# Altium schematic sheet MCU.chDoc.SchDoc
size A4; Revision: 0; SheetNumber: 4; SheetTotal: 4
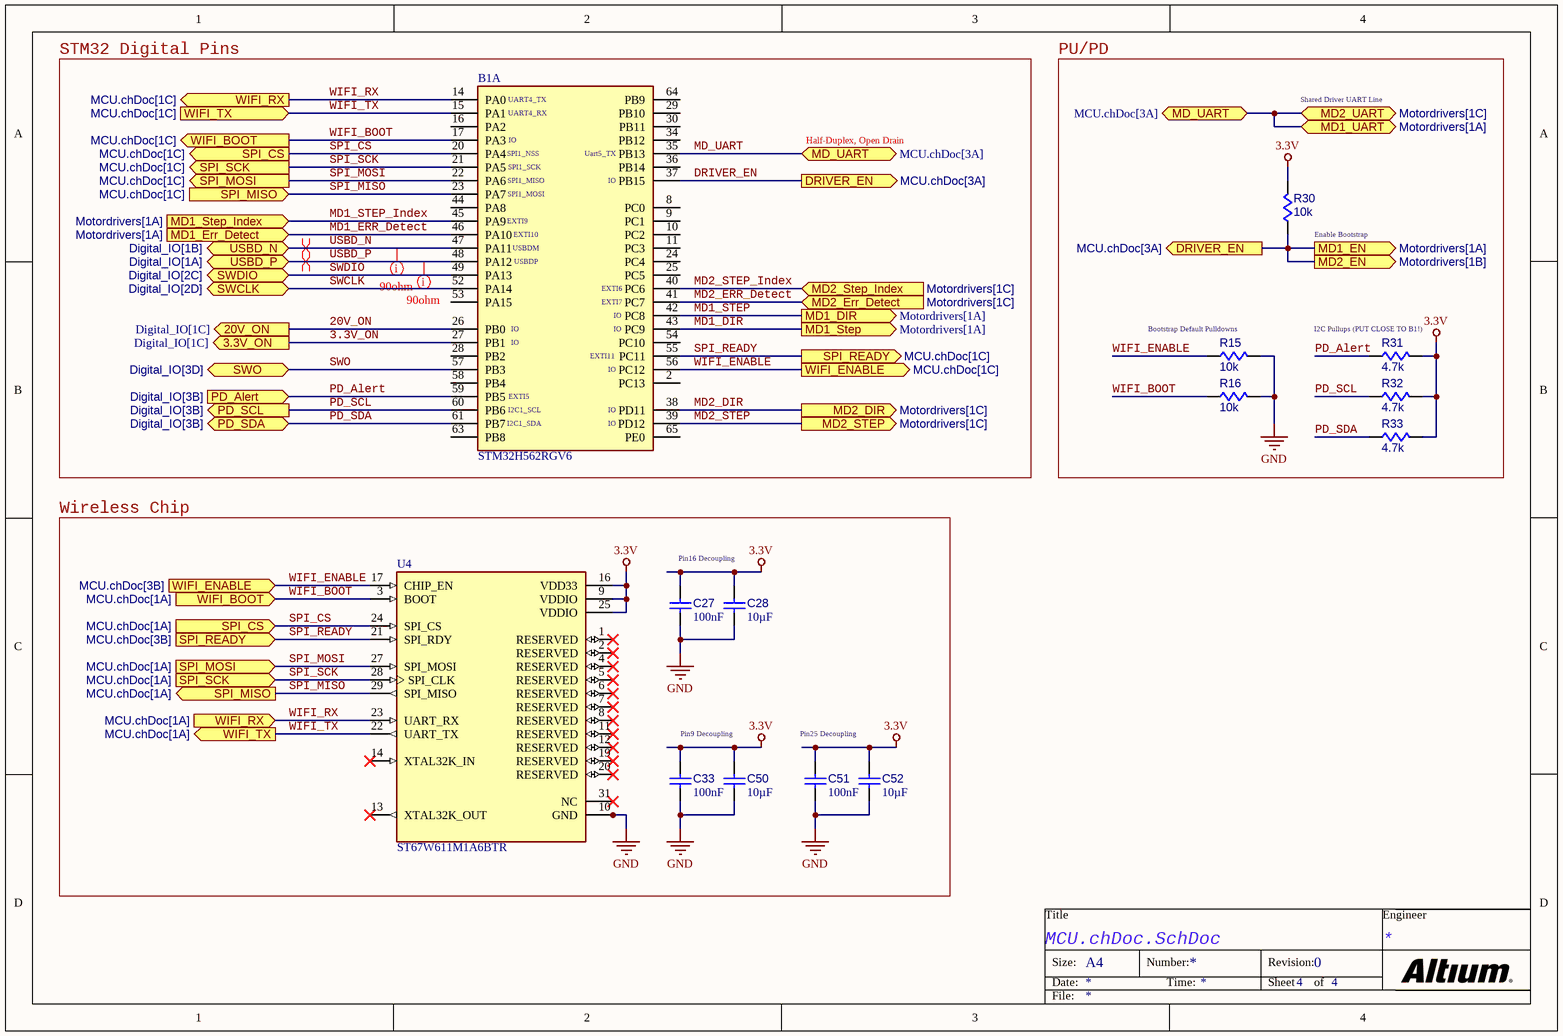
[diagram p0: MCU.chDoc.SchDoc]

## Parts
B1  STM32H562RGV6  [QFN40P800X800X100-69N-D]  (part A of 2)
C27  value 100nF  [CAPC0402(1005)60_L]  (hidden comment: Capacitor 100nF +/-20% 25V 0402)
C28  value 10µF  [CAPC2013X135X45NL10T25]  (hidden comment: Capacitor 10 uF +/- 10% 16 V 0805)
C33  value 100nF  [CAPC0402(1005)60_L]  (hidden comment: Capacitor 100nF +/-20% 25V 0402)
C50  value 10µF  [CAPC2013X135X45NL10T25]  (hidden comment: Capacitor 10 uF +/- 10% 16 V 0805)
C51  value 100nF  [CAPC0402(1005)60_L]  (hidden comment: Capacitor 100nF +/-20% 25V 0402)
C52  value 10µF  [CAPC2013X135X45NL10T25]  (hidden comment: Capacitor 10 uF +/- 10% 16 V 0805)
R15  value 10k  [RESC0402(1005)_L]  (hidden comment: Resistors,0402,10k)
R16  value 10k  [RESC0402(1005)_L]  (hidden comment: Resistors,0402,10k)
R30  value 10k  [RESC0402(1005)_L]  (hidden comment: Resistors,0402,10k)
R31  value 4.7k  [RESC0402(1005)_L]  (hidden comment: Resistors,0402,4.7k)
R32  value 4.7k  [RESC0402(1005)_L]  (hidden comment: Resistors,0402,4.7k)
R33  value 4.7k  [RESC0402(1005)_L]  (hidden comment: Resistors,0402,4.7k)
U4  ST67W611M1A6BTR  [MODULE_ST67W611M1A6BTR]

## Blocks framed on the sheet
STM32 Digital Pins: B1
PU/PD: R15 R16 R30-R33
Wireless Chip: C27 C28 C33 C50-C52 U4

## Ports
3.3V_ON (out, see Digital_IO[1C]), 20V_ON (out, see Digital_IO[1C]), DRIVER_EN (out, see MCU.chDoc[3A]), MD1_DIR (out, see Motordrivers[1A]), MD1_EN (out, see Motordrivers[1A]), MD1_Err_Detect (in, see Motordrivers[1A]), MD1_Step (out, see Motordrivers[1A]), MD1_Step_Index (in, see Motordrivers[1A]), MD1_UART (bidir, see Motordrivers[1A]), MD2_DIR (out, see Motordrivers[1C]), MD2_EN (out, see Motordrivers[1B]), MD2_Err_Detect (in, see Motordrivers[1C]), MD2_STEP (out, see Motordrivers[1C]), MD2_Step_Index (in, see Motordrivers[1C]), MD2_UART (bidir, see Motordrivers[1C]), MD_UART (bidir, see MCU.chDoc[3A]), PD_Alert (in, see Digital_IO[3B]), PD_SCL (out, see Digital_IO[3B]), PD_SDA (bidir, see Digital_IO[3B]), SPI_CS (in, see MCU.chDoc[1A]), SPI_CS (out, see MCU.chDoc[1C]), SPI_MISO (in, see MCU.chDoc[1C]), SPI_MISO (out, see MCU.chDoc[1A]), SPI_MOSI (in, see MCU.chDoc[1A]), SPI_MOSI (out, see MCU.chDoc[1C]), SPI_READY (in, see MCU.chDoc[3B]), SPI_READY (out, see MCU.chDoc[1C]), SPI_SCK (in, see MCU.chDoc[1A]), SPI_SCK (out, see MCU.chDoc[1C]), SWCLK (bidir, see Digital_IO[2D]), SWDIO (bidir, see Digital_IO[2C]), SWO (bidir, see Digital_IO[3D]), USBD_N (bidir, see Digital_IO[1B]), USBD_P (bidir, see Digital_IO[1A]), WIFI_BOOT (in, see MCU.chDoc[1A]), WIFI_BOOT (out, see MCU.chDoc[1C]), WIFI_ENABLE (in, see MCU.chDoc[3B]), WIFI_ENABLE (out, see MCU.chDoc[1C]), WIFI_RX (in, see MCU.chDoc[1A]), WIFI_RX (out, see MCU.chDoc[1C]), WIFI_TX (in, see MCU.chDoc[1C]), WIFI_TX (out, see MCU.chDoc[1A])

## Nets
3.3V: C27.2 C28.2 C33.2 C50.2 C51.2 C52.2 R30.2 R31.2 R32.2 R33.2 U4.9(VDDIO) U4.16(VDD33) U4.25(VDDIO)
GND: C27.1 C28.1 C33.1 C50.1 C51.1 C52.1 R15.2 R16.2 U4.10(GND) U4.15(GND) U4.18(GND) U4.26(GND) U4.30(GND) U4.32(GND) U4.33(GND) U4.34(GND) U4.35(GND) U4.36(GND)
3.3V_ON: B1.27(PB1) ; port 3.3V_ON
20V_ON: B1.26(PB0) ; port 20V_ON
DRIVER_EN: B1.37(PB15) R30.1 ; port MD1_EN, port MD2_EN, port DRIVER_EN
MD1_DIR: B1.43(PC9) ; port MD1_Step
MD1_ERR_Detect: B1.46(PA10) ; port MD1_Err_Detect
MD1_STEP: B1.42(PC8) ; port MD1_DIR
MD1_STEP_Index: B1.45(PA9) ; port MD1_Step_Index
MD2_DIR: B1.38(PD11) ; port MD2_DIR
MD2_ERR_Detect: B1.41(PC7) ; port MD2_Err_Detect
MD2_STEP: B1.39(PD12) ; port MD2_STEP
MD2_STEP_Index: B1.40(PC6) ; port MD2_Step_Index
MD_UART: B1.35(PB13) ; port MD1_UART, port MD2_UART, port MD_UART
PD_Alert: B1.59(PB5) R31.1 ; port PD_Alert
PD_SCL: B1.60(PB6) R32.1 ; port PD_SCL
PD_SDA: B1.61(PB7) R33.1 ; port PD_SDA
SPI_CS: B1.20(PA4) U4.24(SPI_CS) ; port SPI_CS
SPI_MISO: B1.23(PA7) U4.29(SPI_MISO) ; port SPI_MISO
SPI_MOSI: B1.22(PA6) U4.27(SPI_MOSI) ; port SPI_MOSI
SPI_READY: B1.55(PC11) U4.21(SPI_RDY) ; port SPI_READY
SPI_SCK: B1.21(PA5) U4.28(SPI_CLK) ; port SPI_SCK
SWCLK: B1.52(PA14) ; port SWCLK
SWDIO: B1.49(PA13) ; port SWDIO
SWO: B1.57(PB3) ; port SWO
USBD_N: B1.47(PA11) ; port USBD_N
USBD_P: B1.48(PA12) ; port USBD_P
WIFI_BOOT: B1.17(PA3) R16.1 U4.3(BOOT) ; port WIFI_BOOT
WIFI_ENABLE: B1.56(PC12) R15.1 U4.17(CHIP_EN) ; port WIFI_ENABLE
WIFI_RX: B1.14(PA0) U4.23(UART_RX) ; port WIFI_RX
WIFI_TX: B1.15(PA1) U4.22(UART_TX) ; port WIFI_TX

Not connected (* = marked no-connect by the designer): B1 2(PC13) 8(PC0) 9(PC1) 10(PC2) 11(PC3) 16(PA2) 24(PC4) 25(PC5) 28(PB2) 29(PB10) 30(PB11) 34(PB12) 36(PB14) 44(PA8) 53(PA15) 54(PC10) 58(PB4) 63(PB8) 64(PB9) 65(PE0); U4 1(RESERVED)* 2(RESERVED)* 4(RESERVED)* 5(RESERVED)* 6(RESERVED)* 7(RESERVED)* 8(RESERVED)* 11(RESERVED)* 12(RESERVED)* 13(XTAL32K_OUT)* 14(XTAL32K_IN)* 19(RESERVED)* 20(RESERVED)* 31(NC)*

## Layout directives
mark named 90ohm: USBD_N, USBD_P
differential pair: USBD_N, USBD_P

## Notes on the sheet
- (near B1) UART4_TX
- (near B1) UART4_RX
- Shared Driver UART Line
- (near B1) IO
- (near B1) SPI1_NSS
- (near B1) SPI1_SCK
- (near B1) SPI1_MISO
- (near B1) Uart5_TX
- Half-Duplex, Open Drain
- (near B1) EXTI9
- (near B1) SPI1_MOSI
- (near B1) USBDM
- (near B1) EXTI10
- (near R30) Enable Bootstrap
- (near B1) USBDP
- (near B1) EXTI6
- (near B1) EXTI7
- (near B1) EXTI11
- (near R15) Bootstrap Default Pulldowns
- (near R31) I2C Pullups (PUT CLOSE TO B1!)
- (near B1) EXTI5
- (near B1) I2C1_SCL
- (near B1) I2C1_SDA
- Pin16 Decoupling
- Pin9 Decoupling
- Pin25 Decoupling
- Title
- Engineer
- Size:
- Date:
- A4
- Number:
- Time:
- Revision:
- Sheet
- of
- File:

## Library data of the parts
B1 = CMP-004-000001-1: MCU 32-bit ARM Cortex M33 RISC 1MB Flash 1.8V/2.5V/3.3V 68-Pin VFQFPN EP Tray; Manufacturer_Name: STMicroelectronics; Geometry.Height: 1mm; Core Architecture: ARM Cortex-M33; Datasheet Link: https://www.st.com/resource/en/datasheet/stm32h562ag.pdf; Mouser Price/Stock: https://www.mouser.co.uk/ProductDetail/STMicroelectronics/STM32H563RGV6?qs=Jm2GQyTW%2FbjkEO3Um3%252BxKg%3D%3D; Mouser Part Number: 511-STM32H563RGV6; Design Item ID: STM32H563RGV6; Manufacturer_Part_Number: STM32H563RGV6; Source: STM32H563RGV6.SchLib; Memory Format: FLASH; REACH SVHC: Yes; Lifecycle Status: Production; Pins: 68; China RoHS: Compliant; RoHS: Compliant
C27 C33 C51 = CMP-001-00065-7: Chip Capacitor, 100nF +/-20%, 25V, 0402, Thickness 0.6 mm; Tolerance: 10%; Mounting Technology: SMT; Case/Package: 0402; Pins: 2; Min Operating Temperature: -55°C; Max Operating Temperature: 85°C; Voltage Rating: 25V
C28 C50 C52 = CMP-001-00015-9: Chip Capacitor, 10 uF, +/- 10%, 16 V, 0805 (2012 Metric); Capacitor Type: Ceramic; Voltage Rating: 16V; Mounting Technology: SM; Case/Package: 0805; Pins: 2; RoHS Compliant: True; Min Operating Temperature: -55°C; Max Operating Temperature: 85°C; Tolerance: 10%
R15 R16 = Resistors: Resistor, Pulldown; Case/Package: 0402; Component Type: Resistors
R30-R33 = Resistors: Resistor, Pullup; Case/Package: 0402; Component Type: Resistors
U4 = CMP-014-000001-5: 802.15.4, Bluetooth, WiFi 802.11b/g/n/ax, Bluetooth v5.4, Thread, ZigbeeÂ® Transceiver Module 2.4GHz PCB Trace Surface Mount; MF: STMicroelectronics; Package: None; Pin Count: 36; Component Type: Standard; Design Item ID: ST67W611M1A6BTR; Source: ST67W611M1A6BTR.SchLib; MP: ST67W611M1A6BTR; SnapEDA_Link: https://www.snapeda.com/parts/ST67W611M1A6BTR/STMicroelectronics/view-part/?ref=snap; Check_prices: https://www.snapeda.com/parts/ST67W611M1A6BTR/STMicroelectronics/view-part/?ref=eda; Value: *